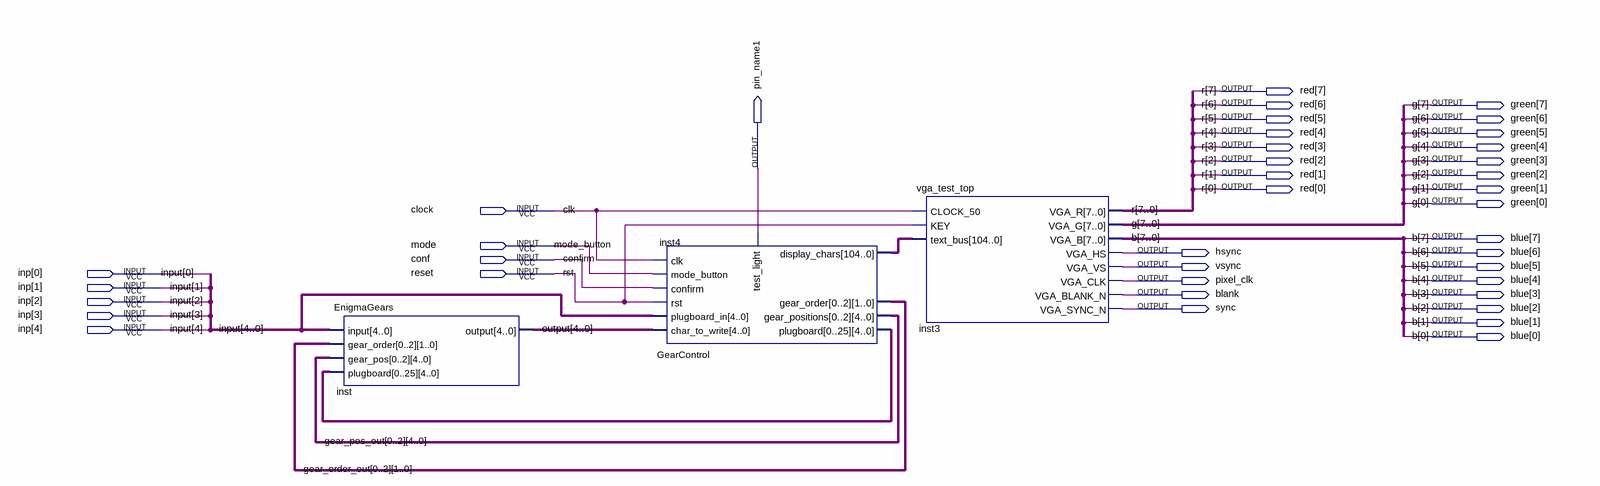
[diagram p0: schematic sheet]
// Quartus schematic Engima.bdf as structural Verilog: 3 symbols, 39 pins
module Engima (
  input  clock,
  input  mode,
  input  conf,
  input  [4:0] inp,
  input  reset,
  output [7:0] red,
  output [7:0] green,
  output pin_name1,
  output [7:0] blue,
  output hsync,
  output vsync,
  output pixel_clk,
  output blank,
  output sync
);

  wire [1:0] gear_order_out_0, gear_order_out_1, gear_order_out_2;
  wire [4:0] gear_pos_out_0, gear_pos_out_1, gear_pos_out_2, \output ;
  wire [104:0] inst4_display_chars;
  wire [129:0] inst4_plugboard;

  EnigmaGears inst (
    .\input (inp), .gear_order({gear_order_out_0, gear_order_out_1, gear_order_out_2}),
    .gear_pos({gear_pos_out_0, gear_pos_out_1, gear_pos_out_2}), .plugboard(inst4_plugboard),
    .\output (\output ));
  GearControl inst4 (
    .char_to_write(\output ), .plugboard_in(inp), .rst(reset), .confirm(conf), .mode_button(mode),
    .clk(clock), .display_chars(inst4_display_chars), .test_light(pin_name1),
    .gear_order({gear_order_out_0, gear_order_out_1, gear_order_out_2}),
    .gear_positions({gear_pos_out_0, gear_pos_out_1, gear_pos_out_2}), .plugboard(inst4_plugboard));
  vga_test_top inst3 (
    .CLOCK_50(clock), .KEY(reset), .text_bus(inst4_display_chars), .VGA_R(red), .VGA_G(green), .VGA_B(blue),
    .VGA_HS(hsync), .VGA_VS(vsync), .VGA_CLK(pixel_clk), .VGA_BLANK_N(blank), .VGA_SYNC_N(sync));

  // Other names for the same wires on the sheet: b[7:0] = blue; clk = clock; confirm = conf; g[7:0] = green;
  //   input[4:0] = inp; mode_button = mode; r[7:0] = red; rst = reset
endmodule
